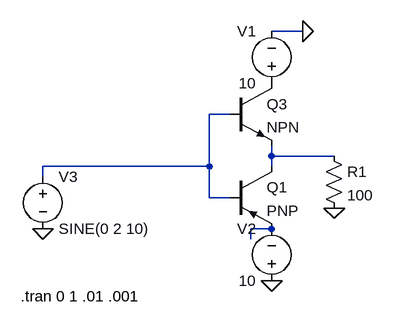
[diagram p0: schematic Draft1.asc]
Draft1.asc, the LTspice schematic file:
Version 4
SHEET 1 880 680
WIRE 256 -80 208 -80
WIRE 144 48 112 48
WIRE 208 112 208 96
WIRE 304 112 208 112
WIRE 112 128 112 48
WIRE 112 128 -144 128
WIRE 208 128 208 112
WIRE -144 144 -144 128
WIRE 112 176 112 128
WIRE 144 176 112 176
WIRE 208 224 176 224
WIRE 176 240 176 224
FLAG 208 304 0
FLAG 256 -80 0
FLAG 304 192 0
FLAG -144 224 0
SYMBOL pnp 144 128 R0
SYMATTR InstName Q1
SYMBOL npn 144 0 R0
SYMATTR InstName Q3
SYMBOL voltage 208 16 R180
WINDOW 0 24 96 Left 2
WINDOW 3 24 16 Left 2
WINDOW 123 0 0 Left 0
WINDOW 39 0 0 Left 0
SYMATTR InstName V1
SYMATTR Value 10
SYMBOL voltage 208 320 R180
WINDOW 0 24 96 Left 2
WINDOW 3 24 16 Left 2
WINDOW 123 0 0 Left 0
WINDOW 39 0 0 Left 0
SYMATTR InstName V2
SYMATTR Value 10
SYMBOL res 288 96 R0
SYMATTR InstName R1
SYMATTR Value 100
SYMBOL voltage -144 128 R0
WINDOW 123 0 0 Left 0
WINDOW 39 0 0 Left 0
SYMATTR InstName V3
SYMATTR Value SINE(0 2 10)
TEXT -178 328 Left 2 !.tran 0 1 .01 .001

The netlist it stands for:
* Draft1.asc
Q1 N002 N001 N003 0 PNP
Q3 P001 N001 N002 0 NPN
V1 P001 0 10
V2 0 N003 10
R1 N002 0 100
V3 N001 0 SINE(0 2 10)
.model NPN NPN
.model PNP PNP
.lib standard.bjt
.tran 0 1 .01 .001
.backanno
.end